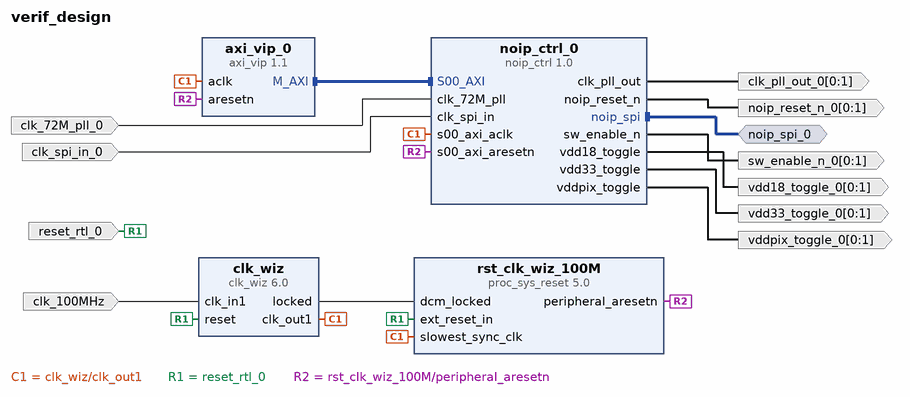
[diagram p0: block diagram of the top level]
# Vivado block design verif_design, xc7z020clg400-2, Vivado 2024.1
create_bd_design verif_design

create_bd_intf_port -mode Master -vlnv xilinx.com:interface:spi_rtl:1.0 noip_spi_0
create_bd_port -dir O -from 0 -to 1 sw_enable_n_0
create_bd_port -dir O -from 0 -to 1 vddpix_toggle_0
create_bd_port -dir O -from 0 -to 1 vdd33_toggle_0
create_bd_port -dir O -from 0 -to 1 vdd18_toggle_0
create_bd_port -dir O -from 0 -to 1 noip_reset_n_0
create_bd_port -dir O -from 0 -to 1 clk_pll_out_0
create_bd_port -dir I clk_72M_pll_0
create_bd_port -dir I clk_spi_in_0
create_bd_port -dir I -type clk clk_100MHz
set_property -dict {CONFIG.FREQ_HZ 100000000} [get_bd_ports clk_100MHz]
create_bd_port -dir I -type rst reset_rtl_0
set_property -dict {CONFIG.POLARITY ACTIVE_HIGH} [get_bd_ports reset_rtl_0]

create_bd_cell -type ip -vlnv user.org:user:noip_ctrl:1.0 noip_ctrl_0
create_bd_cell -type ip -vlnv xilinx.com:ip:axi_vip:1.1 axi_vip_0
set_property -dict [list \
  CONFIG.ADDR_WIDTH 32 \
  CONFIG.DATA_WIDTH 32 \
  CONFIG.HAS_BRESP 1 \
  CONFIG.HAS_PROT 1 \
  CONFIG.HAS_RRESP 1 \
  CONFIG.HAS_WSTRB 1 \
  CONFIG.INTERFACE_MODE MASTER \
  CONFIG.PROTOCOL AXI4LITE \
  CONFIG.READ_WRITE_MODE READ_WRITE \
] [get_bd_cells axi_vip_0]
create_bd_cell -type ip -vlnv xilinx.com:ip:clk_wiz:6.0 clk_wiz
set_property -dict {CONFIG.CLKOUT1_REQUESTED_OUT_FREQ 100} [get_bd_cells clk_wiz]
create_bd_cell -type ip -vlnv xilinx.com:ip:proc_sys_reset:5.0 rst_clk_wiz_100M

# ---- connections ----

connect_bd_intf_net [get_bd_intf_pins axi_vip_0/M_AXI] [get_bd_intf_pins noip_ctrl_0/S00_AXI]
connect_bd_intf_net [get_bd_intf_ports noip_spi_0] [get_bd_intf_pins noip_ctrl_0/noip_spi]
connect_bd_net [get_bd_pins clk_wiz/clk_out1] \
  [get_bd_pins axi_vip_0/aclk] [get_bd_pins rst_clk_wiz_100M/slowest_sync_clk] [get_bd_pins noip_ctrl_0/s00_axi_aclk]
connect_bd_net [get_bd_ports clk_100MHz] [get_bd_pins clk_wiz/clk_in1]
connect_bd_net -net clk_72M_pll_0_1 [get_bd_ports clk_72M_pll_0] [get_bd_pins noip_ctrl_0/clk_72M_pll]
connect_bd_net -net clk_spi_in_0_1 [get_bd_ports clk_spi_in_0] [get_bd_pins noip_ctrl_0/clk_spi_in]
connect_bd_net [get_bd_pins clk_wiz/locked] [get_bd_pins rst_clk_wiz_100M/dcm_locked]
connect_bd_net [get_bd_pins noip_ctrl_0/clk_pll_out] [get_bd_ports clk_pll_out_0]
connect_bd_net [get_bd_pins noip_ctrl_0/noip_reset_n] [get_bd_ports noip_reset_n_0]
connect_bd_net [get_bd_pins noip_ctrl_0/sw_enable_n] [get_bd_ports sw_enable_n_0]
connect_bd_net [get_bd_pins noip_ctrl_0/vdd18_toggle] [get_bd_ports vdd18_toggle_0]
connect_bd_net [get_bd_pins noip_ctrl_0/vdd33_toggle] [get_bd_ports vdd33_toggle_0]
connect_bd_net [get_bd_pins noip_ctrl_0/vddpix_toggle] [get_bd_ports vddpix_toggle_0]
connect_bd_net -net reset_rtl_0_1 [get_bd_ports reset_rtl_0] [get_bd_pins clk_wiz/reset] [get_bd_pins rst_clk_wiz_100M/ext_reset_in]
connect_bd_net [get_bd_pins rst_clk_wiz_100M/peripheral_aresetn] [get_bd_pins axi_vip_0/aresetn] [get_bd_pins noip_ctrl_0/s00_axi_aresetn]

# ---- address map ----
assign_bd_address -offset 0x44A00000 -range 64K -target_address_space [get_bd_addr_spaces axi_vip_0/Master_AXI] [get_bd_addr_segs noip_ctrl_0/S00_AXI/S00_AXI_reg]

validate_bd_design
save_bd_design
